# Altium schematic sheet ECGAquisitionBoard.SchDoc
size A2; SheetNumber: 1; SheetTotal: 1
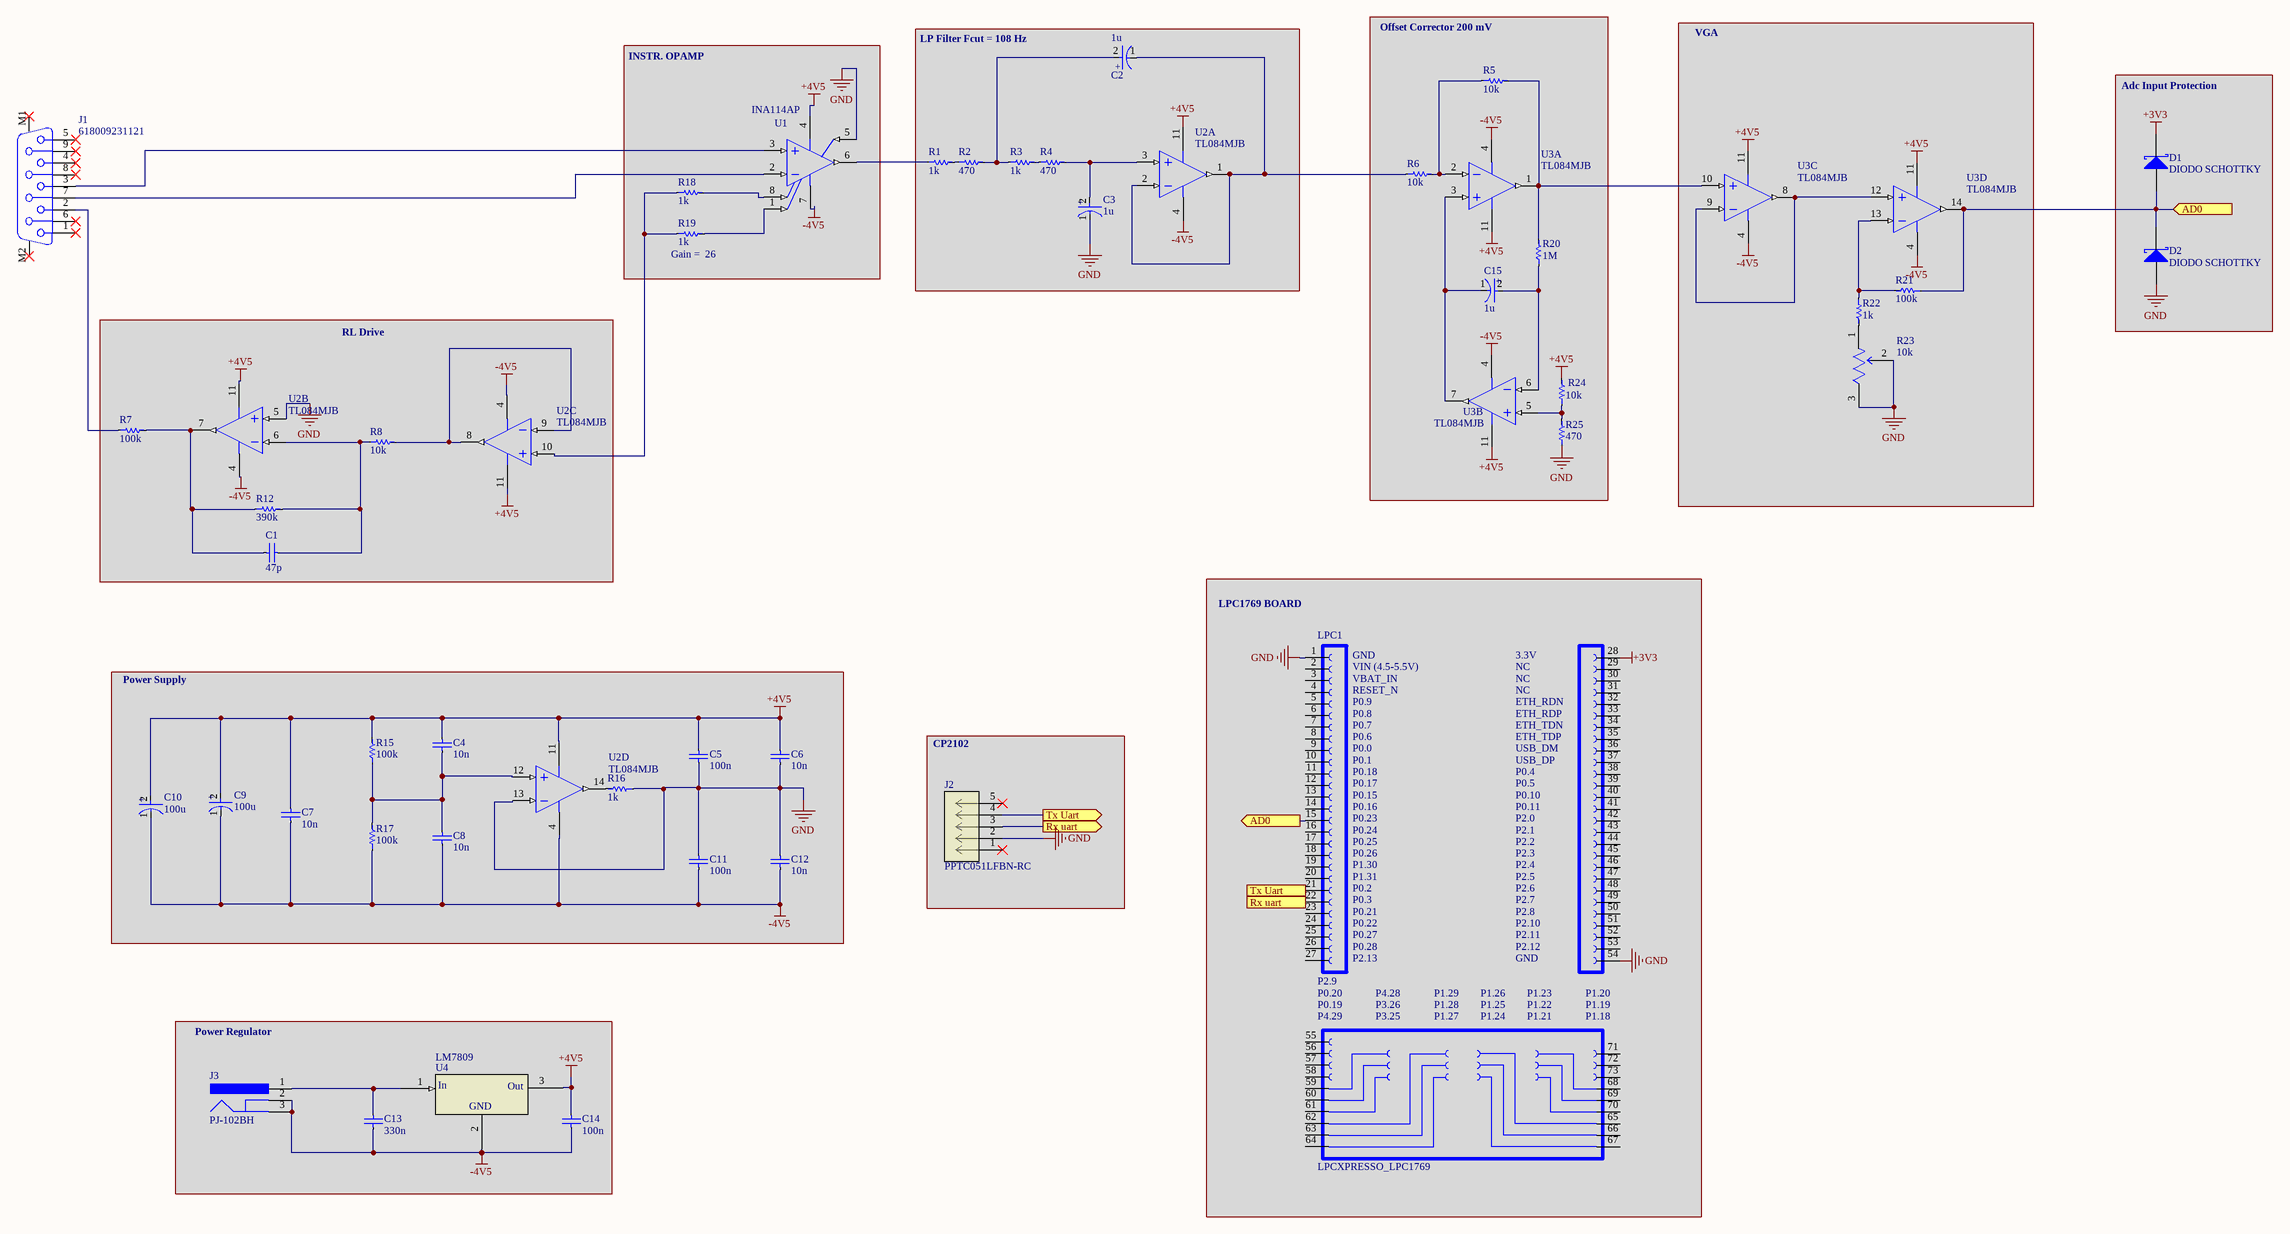
[diagram p0: ECGAquisitionBoard.SchDoc]

## Parts
C1  47p  [CAP SMD 1206]
C2  1u  [FP-RAD-TH-D_5_0_5-L_11_1-MFG]
C3  1u  [FP-RAD-TH-D_5_0_5-L_11_1-MFG]
C4  10n  [CAP SMD 1206]
C5  100n  [CAP SMD 1206]
C6  10n  [CAP SMD 1206]
C7  10n  [CAP SMD 1206]
C8  10n  [CAP SMD 1206]
C9  100u  [FP-RAD-TH-D_5_0_5-L_11_1-MFG]
C10  100u  [FP-RAD-TH-D_5_0_5-L_11_1-MFG]
C11  100n  [CAP SMD 1206]
C12  10n  [CAP SMD 1206]
C13  330n  [CAP SMD 1206]
C14  100n  [CAP SMD 1206]
C15  1u  [FP-RAD-TH-D_5_0_5-L_11_1-MFG]
D1  DIODO SCHOTTKY  [DO-41]
D2  DIODO SCHOTTKY  [DO-41]
J1  618009231121  [618009231121]
J2  PPTC051LFBN-RC  [HEADER 5 F 90DEG]
J3  PJ-102BH  [CUI-PJ-102BH_V]
LPC1  LPCXPRESSO_LPC1769  [LPCXPRESSO_LPC1769]
R1  1k  [RES SMD 1206]
R2  470  [RES SMD 1206]
R3  1k  [RES SMD 1206]
R4  470  [RES SMD 1206]
R5  10k  [RES SMD 1206]
R6  10k  [RES SMD 1206]
R7  100k  [RES SMD 1206]
R8  10k  [RES SMD 1206]
R12  390k  [RES SMD 1206]
R15  100k  [RES SMD 1206]
R16  1k  [RES SMD 1206]
R17  100k  [RES SMD 1206]
R18  1k  [RES SMD 1206]
R19  1k  [RES SMD 1206]
R20  1M  [RES SMD 1206]
R21  100k  [RES SMD 1206]
R22  1k  [RES SMD 1206]
R23  10k  [FP-3296W-MFG]
R24  10k  [RES SMD 1206]
R25  470  [RES SMD 1206]
U1  INA114AP  [P0008A]
U2  TL084MJB  [J0014A]  (parts A,B,C,D of 4)
U3  TL084MJB  [J0014A]  (parts A,B,C,D of 4)
U4  LM7809  [LM7809]

## Blocks framed on the sheet
LP Filter Fcut = 108 Hz: C2 C3 R1-R4 U2
Offset Corrector 200 mV: C15 R5 R6 R20 R24 R25 U3
VGA: R21-R23 U3
Adc Input Protection: D1 D2
RL Drive: C1 R7 R8 R12 U2
LPC1769 BOARD: LPC1
Power Supply: C4-C12 R15-R17 U2
CP2102: J2
Power Regulator: C13 C14 J3 U4

## Ports
AD0 (in), AD0 (out), Rx uart (in), Rx uart (out), Tx Uart (in), Tx Uart (out)

## Nets
+3V3: D1.2(K) LPC1.28
+4V5: C4.2 C5.2 C6.2 C7.2 C9.2(A) C10.2(A) C14.2 R15.2 R24.2 U1.4(V-) U2.11(VCC-) U3.11(VCC-) U4.3(OUTPUT)
-4V5: C7.1 C8.1 C9.1(C) C10.1(C) C11.1 C12.1 C13.1 C14.1 J3.2 J3.3 R17.1 U1.7(V+) U2.4(VCC+) U3.4(VCC+) U4.2(GROUND)
GND: C3.1(C) C5.1 C6.1 C11.2 C12.2 D2.1(A) J2.2 LPC1.1 LPC1.54 R16.1 R23.2(WIPER) R23.3(CW) R25.1 U1.5(REF) U2.5(IN2+) U2.13(IN4-)
AD0: D1.1(A) D2.2(K) LPC1.15 R21.1 U3.14(OUT4) ; port AD0
Rx uart: J2.3 LPC1.22 ; port Rx uart
Tx Uart: J2.4 LPC1.21 ; port Tx Uart
NetC1_1: C1.1 R7.2 R12.1 U2.7(OUT2)
NetC1_2: C1.2 R8.1 R12.2 U2.6(IN2-)
NetC2_1: C2.1(C) R6.1 U2.1(OUT1) U2.2(IN1-)
NetC2_2: C2.2(A) R2.2 R3.1
NetC3_2: C3.2(A) R4.2 U2.3(IN1+)
NetC4_1: C4.1 C8.2 R15.1 R17.2 U2.12(IN4+)
NetC13_2: C13.2 J3.1 U4.1(INPUT)
NetC15_1: C15.1(C) U3.3(IN1+) U3.7(OUT2)
NetC15_2: C15.2(A) R20.1 U3.6(IN2-)
NetJ1_2: J1.2 R7.1
NetJ1_3: J1.3 U1.3(VIN+)
NetJ1_7: J1.7 U1.2(VIN-)
NetR1_1: R1.1 U1.6(VO)
NetR1_2: R1.2 R2.1
NetR3_2: R3.2 R4.1
NetR5_1: R5.1 R6.2 U3.2(IN1-)
NetR5_2: R5.2 R20.2 U3.1(OUT1) U3.10(IN3+)
NetR8_2: R8.2 U2.8(OUT3) U2.9(IN3-)
NetR16_2: R16.2 U2.14(OUT4)
NetR18_1: R18.1 R19.1 U2.10(IN3+)
NetR18_2: R18.2 U1.8(RG)
NetR19_2: R19.2 U1.1(RG)
NetR21_2: R21.2 R22.1 U3.13(IN4-)
NetR22_2: R22.2 R23.1(CCW)
NetR24_1: R24.1 R25.2 U3.5(IN2+)
NetU3_8: U3.8(OUT3) U3.9(IN3-) U3.12(IN4+)

Not connected (* = marked no-connect by the designer): J1 1* 4* 5* 6* 8* 9* M1* M2*; J2 1* 5*; LPC1 2 3 4 5 6 7 8 9 10 11 12 13 14 16 17 18 19 20 23 24 25 26 27 29 30 31 32 33 34 35 36 37 38 39 40 41 42 43 44 45 46 47 48 49 50 51 52 53 55 56 57 58 59 60 61 62 63 64 65 66 67 68 69 70 71 72 73

## Notes on the sheet
- INSTR. OPAMP
- (near R19) Gain =  26
- Title
- Docente:
- Date:
- TPI ED3 - Adquisición ECG
- Ing. Migliore Emiliano
- Revision:
- 1.0
- Integrantes:
- Font Julian
- Krede Julian
- Soria Francisco
- (in symbol CMP-05427-000260-1) +
- (in symbol LM7809) In; Out; GND
- (in symbol LPCXPRESSO_LPC1769) GND; 3.3V; VIN (4.5-5.5V); NC; VBAT_IN; RESET_N; P0.9; ETH_RDN; P0.8; ETH_RDP; P0.7; ETH_TDN; P0.6; ETH_TDP; P0.0; USB_DM; P0.1; USB_DP; P0.18; P0.4; P0.17; P0.5; P0.15; P0.10; P0.16; P0.11; P0.23; P2.0; P0.24; P2.1; P0.25; P2.2; P0.26; P2.3; P1.30; P2.4; P1.31; P2.5; P0.2; P2.6; P0.3; P2.7; P0.21; P2.8; P0.22; P2.10; P0.27; P2.11; P0.28; P2.12; P2.13; P2.9; P0.20; P4.28; P1.29; P1.26; P1.23; P1.20; P0.19; P3.26; P1.28; P1.25; P1.22; P1.19; P4.29; P3.25; P1.27; P1.24; P1.21; P1.18

## Library data of the parts
C1 C4-C8 C11-C14 = CAP SMD 1206: CAP 330nF 50V ±10% 1206 (3216 Metric) Thickness 1.9mm SMD; Tolerance: Â±10%; Case-EIA: 1206; Case-Metric: 3216; Technology: SMT; Value: 330nF; Rated Voltage: 50 V; Max Thickness: 1.9 mm
C2 C3 C9 C10 C15 = CMP-05427-000260-1: Aluminum Electrolytic Capacitors (Radial Lead Type) AEC-Q200 Qualified 10uF ±20% 50V; Lead Diameter: 0.5mm; Polarity: Polar; Leakage Current: 3uA; Life (Hours): 1000Hour; Ripple Current: 39mA; Lead/Base Style: Straight; Max Operating Temperature: 105°C; Voltage Rating (DC): 50V; Diameter: 5mm; RoHS Compliant: Yes; Capacitance: 10uF; Packaging: Ammo Pack; Series: NHG; Construction: RADIAL; Length: 11mm; Tolerance: 20%; Height - Seated (Max): 0.472inch; Contact Plating: Tin; Height: 11mm; Min Operating Temperature: -55°C; Radiation Hardening: No; Package Quantity: 2000; Mount: Through Hole; Voltage Rating: 50V; Lead Pitch: 2.5mm; Termination: Radial; Lead Free: Lead Free; Case/Package: Radial
J1 = CMP-1502-00200-2: NexarPartId: 18818187; Insulation Resistance: 5GΩ; Current Rating: 3A; Number of Contacts: 9; Contact Resistance: 30mΩ; Operating Supply Voltage: 125V; Gender: Female; Pitch: 2.77mm; Length: 30.8mm; Contact Material: Gold, Nickel; Insulation Material: PBT; RoHS: Compliant; Width: 12.5mm; Termination: SMD/SMT; Height: 12.7mm; Housing Material: Steel; Number of Pins: 9; Max Operating Temperature: 105°C; Mount: Through Hole; Contact Plating: Gold; Depth: 18.5mm; Min Operating Temperature: -55°C; REACH SVHC: Unknown; Number of Rows: 2; Orientation: Right Angle; Voltage Rating: 125V
J2 = HEADER 5 F 90DEG: Description; Manufacturer_Name: Sullins; Copyright: Copyright (C) 2025 Ultra Librarian. All rights reserved.; Manufacturer_Part_Number: PPTC051LFBN-RC; RefDes: RefDes; Type: Type
J3 = CMP-2000-06901-1: Through Hole Right Angle DC Power Jack, 5 A, 2.5 mm Center Pin, 3 Position, -25 to 85 degC, RoHS, Bulk; Manufacturer: CUIInc.; Outside Contact Diameter: 6.5mm; Current Rating: 5A; Brand: CUI; Insulation Resistance: 100MOhms; Inside Contact Diameter: 2.5mm; Voltage Rating: 24V; Operating Temperature Range: -25Cto+85C; Mounting Angle: Right; Mounting Technology: ThroughHole; Product Category: DCPowerConnectors; Datasheet Version: Rev. 1.02, 05/2016; Connector Type: DCPowerJack; Contact Material: Copper; Housing Material: PolybutyleneTerephthalate(PBT); Mounting Style: ThroughHole; Product: Jacks; Package Reference: PJ-102BH; Manufacturer URL: http://www.cui.com/; RoHS: True; Contact Gender: Male; Contact Plating: Nickel; Flammability Rating: UL94V-0; Factory Pack Quantity: 280; Datasheet URL: http://www.cui.com/product/resource/pj-102bh.pdf; Package Description: 3-Pin Through Hole Device, Body 14.4 x 9 mm, Height 11 mm; Termination Style: ThroughHole
LPC1 = LPCXPRESSO_LPC1769: LPC1768, LPC1769, mbed-Enabled Development LPCXpressoâ„¢ LPC1700 ARMÂ® CortexÂ®-M3 MCU 32-Bit Embedded Evaluation Board; MF: Embedded Artists; MP: LPCXPRESSO LPC1769; SnapEDA_Link: https://www.snapeda.com/parts/LPCXPRESSO%20LPC1769/Embedded%20Artists/view-part/45270/?ref=snap; Value: *; Check_prices: https://www.snapeda.com/parts/LPCXPRESSO%20LPC1769/Embedded%20Artists/view-part/45270/?ref=eda; Package: None; Availability: Unavailable; Price: None
R1-R8 R12 R15-R22 R24 R25 = RES SMD 1206: Resistencia; Published: 8-Jun-2000; LatestRevisionDate: 17-Jul-2002; LatestRevisionNote: Re-released for DXP Platform.; Publisher: Altium Limited
R23 = CMP-07234-000024-1: TRIMMER 10K OHM 0.5W PC PIN TOP; Resistance: 10kR; Temperature Coefficient: 100ppm/°C; Power Rating: 500mW; Tolerance: 10%; Number of Turns: 25; Width: 0.19inch; Termination: Pin; Radiation Hardening: No; Contact Plating: Tin; Composition: Cermet; Length: 9.53mm; Height: 0.395inch; Depth: 4.83mm; REACH SVHC: No SVHC; Weight: 0.03oz; Min Operating Temperature: -55°C; Military Standard: Not; Max Operating Temperature: 125°C; Packaging: Tape and Reel; Package Quantity: 1; Taper: Linear; Max Power Dissipation: 500mW; Mount: Through Hole
U1 = CMP-0992-00143-2: Precision Instrumentation Amplifier, -40 to 85 degC, 8-pin DIP (P8), Green (RoHS & no Sb/Br); Manufacturer: Texas Instruments; Vs(Max)(V): 36; Input Bias Current (+/-)(Max)(nA): 5; Output Offset Drift (+/-)(Max)(uV/Degrees Celsius): 10/G; Non-Linearity (+/-)(Max)(%): 0.004; CMRR(Min)(dB): 106; Output Offset (+/-)(Max)(uV): 500/G; Quiescent Current (+/-)(Typ)(mA): 2.2; Vs(Min)(V): 4.5; Input Offset Drift (+/-)(Max)(uV/Degrees Celsius): 1; Gain(V/V): 1 to 10000; SubFamily: Dual Supply; Input Offset (+/-)(Max)(uV): 125; Noise at 1kHz(Typ)(nV/rt(Hz)): 11; PackageDescription: 8-Pin Plastic In-Line, Body 9.59 x 6.35 mm, Pitch 2.54 mm; Eco-Plan: Green (RoHS & no Sb/Br); ComponentLink3Description: Package Specification; ComponentLink3URL: http://www.ti.com/litv/pdf/mpdi001b; ComponentLink1URL: http://www.ti.com/; PackageReference: P0008A; DatasheetVersion: SBOS014; PackageVersion: 4040082/E, 04/2010; PartNumber: INA114AP; Mounting Technology: Through Hole; ComponentLink2URL: http://www.ti.com/general/docs/lit/getliterature.tsp?genericPartNumber=INA114&fileType=pdf; ComponentLink1Description: Manufacturer URL; Number of Channels: 1; ComponentLink2Description: Datasheet; Code_JEDEC: MS-001
U2 U3 = CMP-0017-00784-2: High Speed JFET-Input Quad Operational Amplifier, -55 to 125 degC, 14-pin DIP (J14); Manufacturer: Texas Instruments; Sub Family: General Purpose Amplifier; Vio (25C)(Max)(mV): 9; Iq per channel(Max)(mA): 2.8; CMRR(Min)(dB): 80; Offset Drift(Typ)(uV/C): 18; GBW(Typ)(MHz): 3; IIB(Max)(pA): 200; Number of Channels: 4; Slew Rate(Typ)(V/us): 13; Rating: Military; PartNumber: TL084MJB; DatasheetVersion: SLOS081G; ComponentLink1URL: http://www.ti.com/; Mounting Technology: Through Hole; PackageVersion: 4040083/F, 03/2003; ComponentLink2Description: Datasheet; ComponentLink2URL: http://www.ti.com/lit/ds/symlink/tl084m.pdf; ComponentLink3URL: http://www.ti.com/litv/pdf/mcer002d; PackageReference: J0014A; PackageDescription: 14-Pin Ceramic, Glass In-Line, Row Spacing 7.62 mm, Pitch 2.54 mm; ComponentLink3Description: Package Specification; Vn at 1kHz(Typ)(nV/rtHz): 18; ComponentLink1Description: Manufacturer URL
U4 = LM7809: No Description Available; Manufacturer_Name: onsemi; Manufacturer_Part_Number: MC7809CTG; Copyright: Copyright (C) 2025 Ultra Librarian. All rights reserved.; RefDes: RefDes; Type: Type
D1 D2 = DIODO SCHOTTKY: Part Number: *; Manufacturer: *; Code Prov1: *; Prov1: *